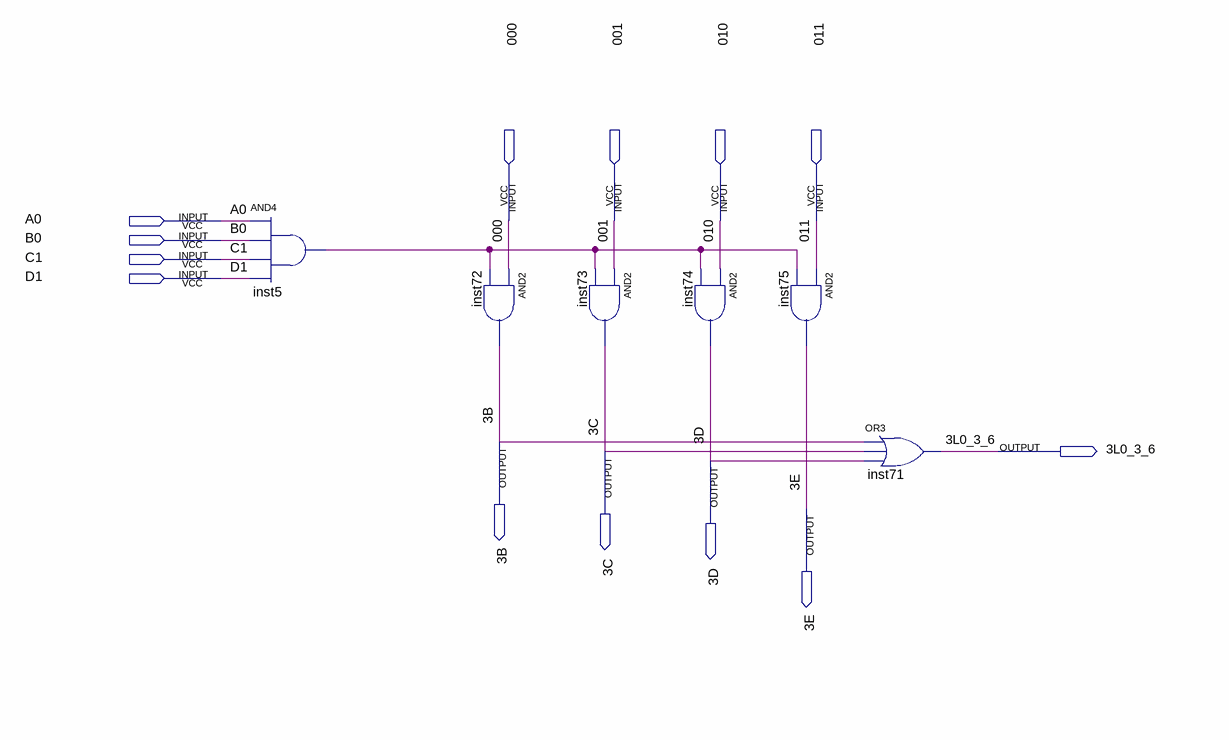
[diagram p0: schematic sheet]
// Quartus schematic carac3.bdf as structural Verilog: 6 symbols, 13 pins
module carac3 (
  input  A0,
  input  \000 ,
  input  \001 ,
  input  \010 ,
  input  \011 ,
  input  B0,
  input  C1,
  input  D1,
  output \3B ,
  output \3C ,
  output \3L0_3_6 ,
  output \3D ,
  output \3E 
);

  wire inst5_out;

  and inst5 (inst5_out, A0, B0, C1, D1);
  and inst72 (\3B , \000 , inst5_out);
  and inst73 (\3C , \001 , inst5_out);
  and inst74 (\3D , \010 , inst5_out);
  and inst75 (\3E , \011 , inst5_out);
  or inst71 (\3L0_3_6 , \3B , \3C , \3D );
endmodule
